# EAGLE design feather-board (EAGLE 7.4.0)
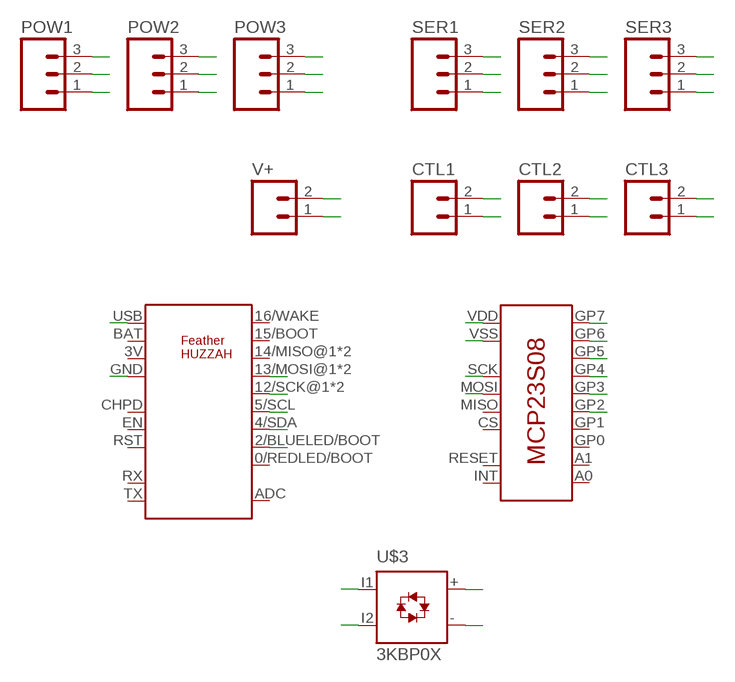
[diagram p0: schematic, sheet 1]

## Parts
CTL1  M021X02_NO_SILK  [1X02_NO_SILK]
CTL2  M021X02_NO_SILK  [1X02_NO_SILK]
CTL3  M021X02_NO_SILK  [1X02_NO_SILK]
POW1  M031X03_NO_SILK  [1X03_NO_SILK]
POW2  M031X03_NO_SILK  [1X03_NO_SILK]
POW3  M031X03_NO_SILK  [1X03_NO_SILK]
SER1  M031X03_NO_SILK  [1X03_NO_SILK]
SER2  M031X03_NO_SILK  [1X03_NO_SILK]
SER3  M031X03_NO_SILK  [1X03_NO_SILK]
U$1  ADAFRUITFEATHER  [ADAFRUITFEATHER]
U$2  MCP23S08  [MCP23S08]
U$3  3KBP0X  [3KBP0X]
V+  M025MM  [SCREWTERMINAL-5MM-2]

## Nets
CS1: SER1.1 U$1.2/BLUELED/BOOT
CS2: SER2.1 U$1.5/SCL
CS3: SER3.1 U$1.4/SDA
DIR1: CTL1.1 U$2.GP4
DIR2: CTL2.1 U$2.GP3
DIR3: CTL3.1 U$2.GP2
EN1: CTL1.2 U$2.GP5
EN2: CTL2.2 U$2.GP6
EN3: CTL3.2 U$2.GP7
GND: POW1.2 POW2.2 POW3.2 U$1.GND U$2.VSS U$3.-
I1: U$3.I1 V+.2
I2: U$3.I2 V+.1
MOSI: SER1.3 SER2.3 SER3.3 U$1.13/MOSI@1 U$1.13/MOSI@2 U$2.MOSI
SCK: SER1.2 SER2.2 SER3.2 U$1.12/SCK@1 U$1.12/SCK@2 U$2.SCK
V5: POW1.1 POW2.1 POW3.1 U$1.USB U$2.VDD
V+: POW1.3 POW2.3 POW3.3 U$3.+
Unconnected: U$1.0/REDLED/BOOT U$1.3V U$1.14/MISO@1 U$1.14/MISO@2 U$1.15/BOOT U$1.16/WAKE U$1.ADC U$1.BAT U$1.CHPD U$1.EN U$1.RST U$1.RX U$1.TX U$2.A0 U$2.A1 U$2.CS U$2.GP0 U$2.GP1 U$2.INT U$2.MISO U$2.RESET

## Library data of the parts
CTL1-CTL3 = SparkFun-Connectors:M02: Standard 2-pin 0.1" header. Use with - straight break away headers ( PRT-00116) - right angle break away headers (PRT-00553) - swiss pins (PRT-00743) - machine pins (PRT-00117) - female headers (PRT-00115) Molex polarized connector foot print use with: PRT-08233 with associated crimp pins and housings. 2.54_SCREWTERM for use with PRT-10571. 3.5mm Screw Terminal footprints for PRT-08084 5mm Screw Terminal footprints for use with PRT-08432
POW1-POW3 SER1-SER3 = SparkFun-Connectors:M03: Header 3 Standard 3-pin 0.1" header. Use with straight break away headers (SKU : PRT-00116), right angle break away headers (PRT-00553), swiss pins (PRT-00743), machine pins (PRT-00117), and female headers (PRT-00115). Molex polarized connector foot print use with SKU : PRT-08232 with associated crimp pins and housings.
U$1 = custom-parts:ADAFRUITFEATHER
U$2 = custom-parts:MCP23S08
U$3 = custom-parts:3KBP0X
V+ = SparkFun-Connectors:M02: Standard 2-pin 0.1" header. Use with - straight break away headers ( PRT-00116) - right angle break away headers (PRT-00553) - swiss pins (PRT-00743) - machine pins (PRT-00117) - female headers (PRT-00115) Molex polarized connector foot print use with: PRT-08233 with associated crimp pins and housings. 2.54_SCREWTERM for use with PRT-10571. 3.5mm Screw Terminal footprints for PRT-08084 5mm Screw Terminal footprints for use with PRT-08432; STOREFRONT_ID: PRT-08432

## Board
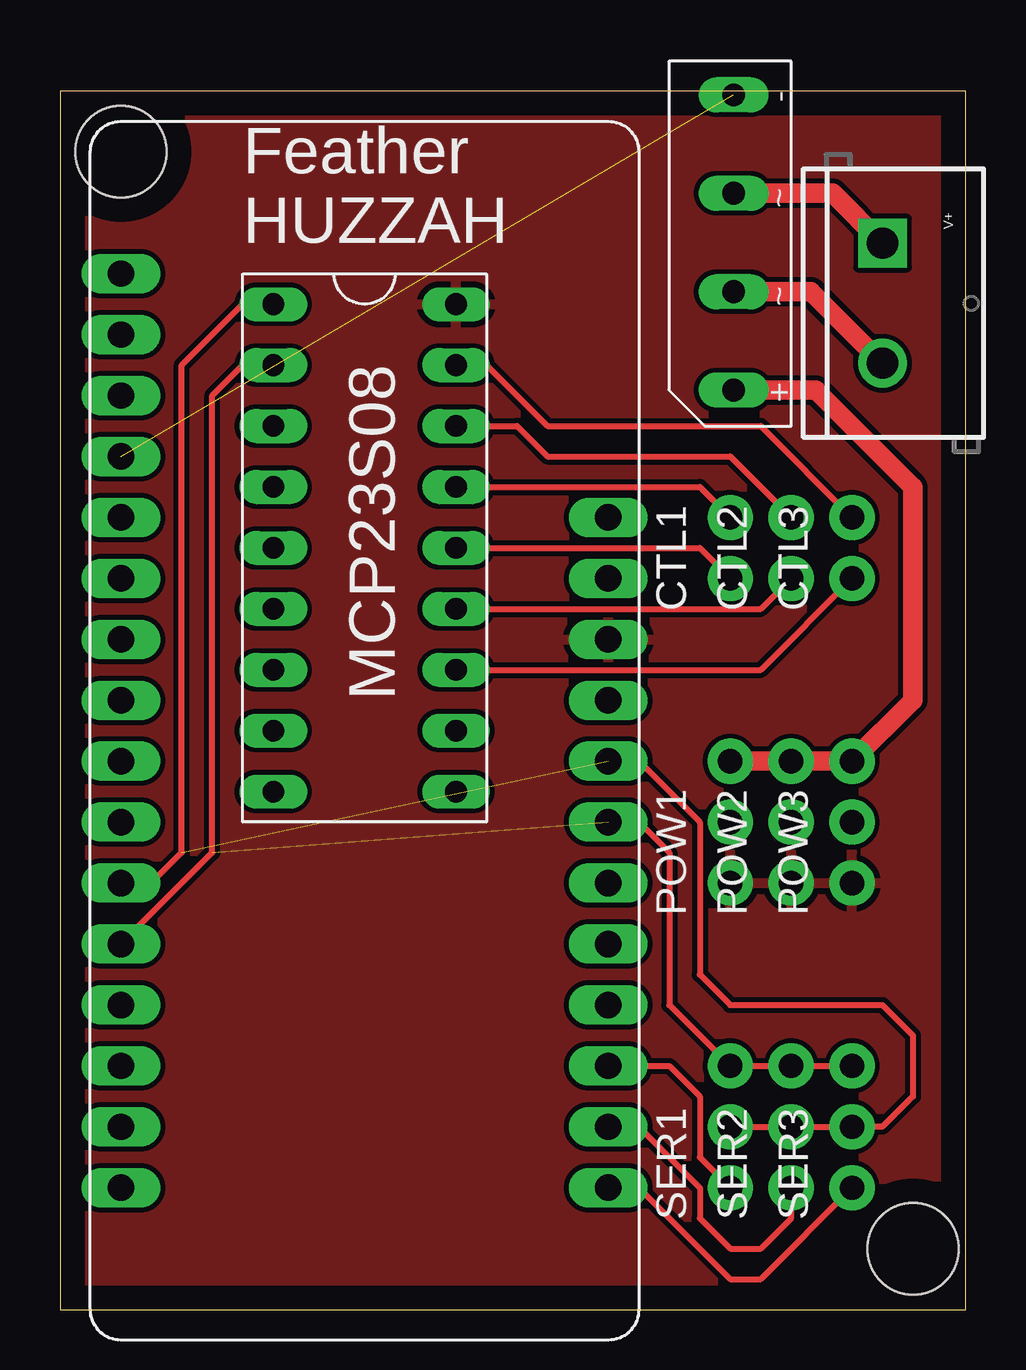
[diagram p1: board, top side]
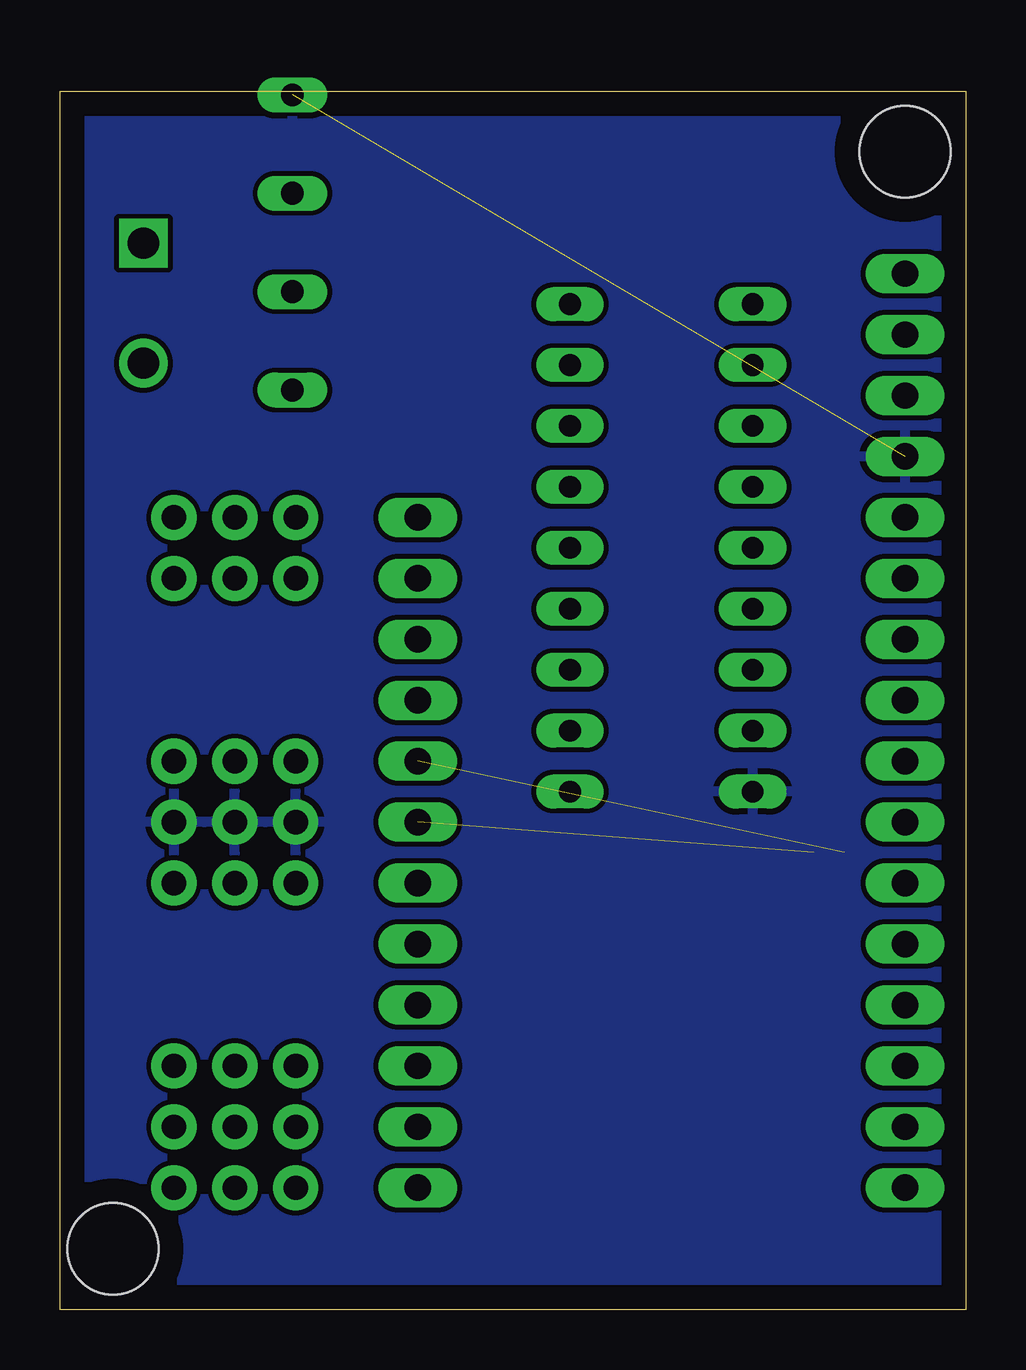
[diagram p2: board, bottom side, seen from below]

Size 37.77 x 50.79 mm. Coordinates in mm from the lower left corner, seen from the top.
Outline: 0,0 37.77,0 37.77,50.79 0,50.79 0,0
Copper layers (1*16): Top 0.035mm / dielectric 1.5mm / Bottom 0.035mm
Design rules "default": minimum track width 10mil, minimum drill 24mil, track to track 8mil, track to pad 8mil, pad to pad 8mil, via to via 8mil, smd to smd 8mil, copper to edge 40mil, drill to drill 8mil, minimum pad ring 10mil, minimum via ring 8mil, stop-mask expansion 4mil, vias tented up to drill 0mil, thermal gap 10mil
Holes 3.81 mm at 35.56,2.54 2.54,48.26

### Footprints (pad centres in the part's own frame; a part is rotated, then mirrored left to right if it is on the bottom)
1X02_NO_SILK = drill 1.016 pad 1.88: 1 0,0; 2 2.54,0
1X03_NO_SILK = drill 1.016 pad 1.88: 1 0,0; 2 2.54,0; 3 5.08,0
ADAFRUITFEATHER = drill 1.1 long: 0/REDLED/BOOT 10.16,-7.62; 2/BLUELED/BOOT 10.16,-12.7; 3V -10.16,17.78; 4/SDA 10.16,-17.78; 5/SCL 10.16,-15.24; 12/SCK@1 10.16,0; 12/SCK@2 -10.16,-5.08; 13/MOSI@1 10.16,-2.54; 13/MOSI@2 -10.16,-7.62; 14/MISO@1 10.16,2.54; 14/MISO@2 -10.16,-10.16; 15/BOOT 10.16,-5.08; 16/WAKE 10.16,-10.16; ADC -10.16,10.16; BAT 10.16,10.16; CHPD -10.16,-17.78; EN 10.16,7.62; GND -10.16,12.7; NC1 -10.16,15.24; NC2 -10.16,7.62; NC3 -10.16,5.08; NC4 -10.16,2.54; NC5 -10.16,0; NC6 -10.16,-2.54; RST -10.16,20.32; RX -10.16,-12.7; TX -10.16,-15.24; USB 10.16,5.08
MCP23S08 = drill 0.9 long: A0 -3.81,0; A1 -3.81,2.54; CS -3.81,-5.08; GP0 3.81,-10.16; GP1 3.81,-7.62; GP2 3.81,-5.08; GP3 3.81,-2.54; GP4 3.81,0; GP5 3.81,2.54; GP6 3.81,5.08; GP7 3.81,7.62; INT -3.81,-7.62; MISO -3.81,5.08; MOSI -3.81,7.62; RESET -3.81,-2.54; SCK -3.81,10.16; VDD 3.81,10.16; VSS -3.81,-10.16
3KBP0X = drill 0.95 long: + 1.5,2.4; - 13.8,2.4; I1 5.6,2.4; I2 9.7,2.4
SCREWTERMINAL-5MM-2 = drill 1.3 pad 2.032 square: 1 0,0 | drill 1.3 pad 2.032: 2 5,0

### Placement (x,y rotation side)
CTL1  27.94,30.48 90 top
CTL2  30.48,30.48 90 top
CTL3  33.02,30.48 90 top
POW1  27.94,17.78 90 top
POW2  30.48,17.78 90 top
POW3  33.02,17.78 90 top
SER1  27.94,5.08 90 top
SER2  30.48,5.08 90 top
SER3  33.02,5.08 90 top
U$1  12.7,22.86 0 top
U$2  12.7,31.75 0 top
U$3  30.48,36.83 90 top
V+  34.29,44.45 270 top

### Tracks (layer width: path | path; a pad name or v marks a point on that pad's centre or on a via)
CS1
  Top 0.254: U$1.2/BLUELED/BOOT 25.4,10.16 26.67,8.89 26.67,6.35 SER1.1
CS2
  Top 0.254: U$1.5/SCL 24.13,7.62 26.67,5.08 26.67,3.81 27.94,2.54 29.21,2.54 30.48,3.81 SER2.1
CS3
  Top 0.254: U$1.4/SDA 24.13,5.08 27.94,1.27 29.21,1.27 SER3.1
DIR1
  Top 0.254: U$2.GP4 26.67,31.75 CTL1.1
DIR2
  Top 0.254: U$2.GP3 29.21,29.21 CTL2.1
DIR3
  Top 0.254: U$2.GP2 29.21,26.67 CTL3.1
EN1
  Top 0.254: U$2.GP5 26.67,34.29 CTL1.2
EN2
  Top 0.254: U$2.GP6 19.05,36.83 20.32,35.56 27.94,35.56 CTL2.2
EN3
  Top 0.254: U$2.GP7 17.78,39.37 20.32,36.83 29.21,36.83 CTL3.2
GND  (1 unrouted)
  pour Bottom: 0,-2.54 0,64.77 50.8,64.77 50.8,-2.54
I1
  Top 0.813: U$3.I1 31.31,42.43 V+.2
I2
  Top 0.813: U$3.I2 32.21,46.53 V+.1
MOSI  (1 unrouted)
  Top 0.254: SER3.3 SER2.3 SER1.3 25.4,12.7 25.4,19.05 24.13,20.32 U$1.13/MOSI@1 | U$1.13/MOSI@2 6.35,19.05 6.35,38.1 7.62,39.37 U$2.MOSI
SCK  (1 unrouted)
  Top 0.254: SER1.2 SER2.2 SER3.2 34.29,7.62 35.56,8.89 35.56,11.43 34.29,12.7 27.94,12.7 26.67,13.97 26.67,20.32 24.13,22.86 U$1.12/SCK@1 | U$1.12/SCK@2 3.81,17.78 5.08,19.05 5.08,39.37 7.62,41.91 U$2.SCK
V5
  pour Top: 0,-2.54 0,62.23 48.26,62.23 48.26,-2.54
V+
  Top 0.813: POW1.3 POW2.3 POW3.3 35.56,25.4 35.56,34.29 31.52,38.33 U$3.+